# EAGLE design bmd-sbus-knobs-v2 (EAGLE 7.7.0)
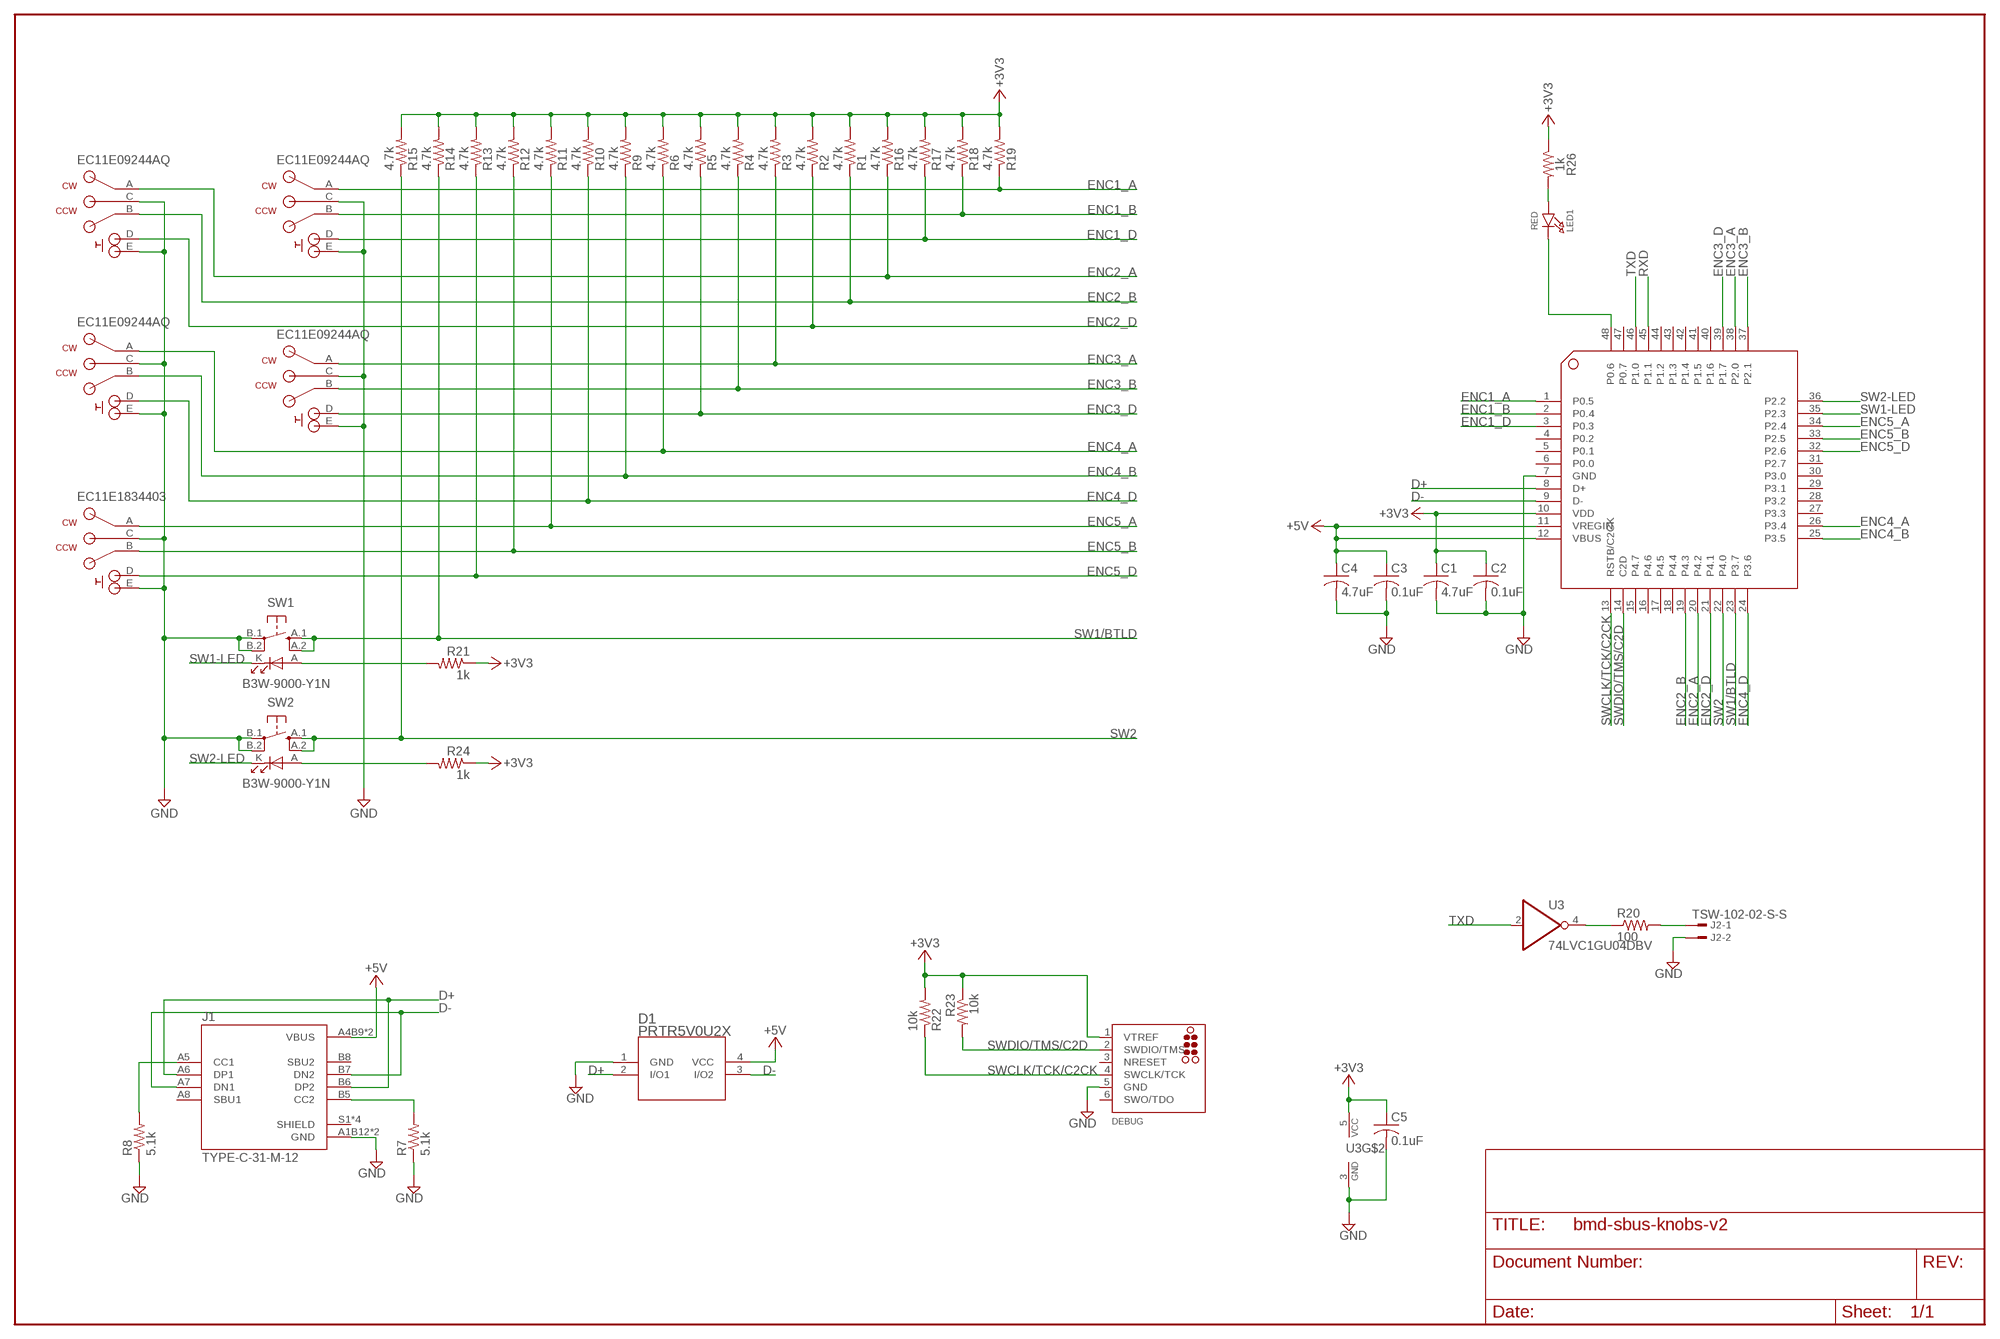
[diagram p0: schematic, sheet 1]

## Parts
C1  4.7uF  C-USC0603K  [C0603K]
C2  0.1uF  C-USC0603K  [C0603K]
C3  0.1uF  C-USC0603K  [C0603K]
C4  4.7uF  C-USC0603K  [C0603K]
C5  0.1uF  C-USC0603  [C0603]
D1  PRTR5V0U2X  [SOT143B]
DEBUG  TC2030-CTX-SWD  [TC2030-MCP-NL]
ENC1  EC11E15244B2  [EC11E15244B2]
ENC2  EC11E15244B2  [EC11E15244B2]
ENC3  EC11E15244B2  [EC11E15244B2]
ENC4  EC11E15244B2  [EC11E15244B2]
ENC5  EC11E15244B2  [EC11E15244B2]
J1  TYPE-C-31-M-12  [HRO_TYPE-C-31-M-12]
J2  TSW-102-02-S-S  [TSW-102-02-S-S]
LED1  RED  LED0805_NOOUTLINE  [CHIPLED_0805_NOOUTLINE]
R1  4.7k  R-US_R0603  [R0603]
R2  4.7k  R-US_R0603  [R0603]
R3  4.7k  R-US_R0603  [R0603]
R4  4.7k  R-US_R0603  [R0603]
R5  4.7k  R-US_R0603  [R0603]
R6  4.7k  R-US_R0603  [R0603]
R7  5.1k  R-US_R0603  [R0603]
R8  5.1k  R-US_R0603  [R0603]
R9  4.7k  R-US_R0603  [R0603]
R10  4.7k  R-US_R0603  [R0603]
R11  4.7k  R-US_R0603  [R0603]
R12  4.7k  R-US_R0603  [R0603]
R13  4.7k  R-US_R0603  [R0603]
R14  4.7k  R-US_R0603  [R0603]
R15  4.7k  R-US_R0603  [R0603]
R16  4.7k  R-US_R0603  [R0603]
R17  4.7k  R-US_R0603  [R0603]
R18  4.7k  R-US_R0603  [R0603]
R19  4.7k  R-US_R0603  [R0603]
R20  100  R-US_R0603  [R0603]
R21  1k  R-US_R0603  [R0603]
R22  10k  R-US_R0603  [R0603]
R23  10k  R-US_R0603  [R0603]
R24  1k  R-US_R0603  [R0603]
R26  1k  R-US_R0603  [R0603]
SW1  B3W-9000-Y1N  OMRON-B3W-9000-B1N  [OMRON-B3W-ILLUM-BUTTON]
SW2  B3W-9000-Y1N  OMRON-B3W-9000-B1N  [OMRON-B3W-ILLUM-BUTTON]
U1  EFM8UB20F64G-B-QFP48  [EFM8UB2-QFP48]
U3  74LVC1GU04DBV  74AHC1GU04DBV  [SOT23-5]

## Nets
+3V3: C1.1 C2.1 C5.1 DEBUG.1(VTREF) R1.2 R2.2 R3.2 R4.2 R5.2 R6.2 R9.2 R10.2 R11.2 R12.2 R13.2 R14.2 R15.2 R16.2 R17.2 R18.2 R19.2 R21.1 R22.2 R23.1 R24.1 R26.1 U1.10(VDD) U3.5(VCC)
+5V: C3.1 C4.1 D1.4(VCC) J1.A4B9(VBUS) J1.B4A9(VBUS) U1.11(VREGIN) U1.12(VBUS)
D+: D1.2(I/O1) J1.A6(DP1) J1.B6(DP2) U1.8(D+)
D-: D1.3(I/O2) J1.A7(DN1) J1.B7(DN2) U1.9(D-)
ENC1_A: ENC1.A R19.1 U1.1(P0.5)
ENC1_B: ENC1.B R18.1 U1.2(P0.4)
ENC1_D: ENC1.D R17.1 U1.3(P0.3)
ENC2_A: ENC2.A R16.1 U1.20(P4.2)
ENC2_B: ENC2.B R1.1 U1.19(P4.3)
ENC2_D: ENC2.D R2.1 U1.21(P4.1)
ENC3_A: ENC3.A R3.1 U1.38(P2.0)
ENC3_B: ENC3.B R4.1 U1.37(P2.1)
ENC3_D: ENC3.D R5.1 U1.39(P1.7)
ENC4_A: ENC4.A R6.1 U1.26(P3.4)
ENC4_B: ENC4.B R9.1 U1.25(P3.5)
ENC4_D: ENC4.D R10.1 U1.24(P3.6)
ENC5_A: ENC5.A R11.1 U1.34(P2.4)
ENC5_B: ENC5.B R12.1 U1.33(P2.5)
ENC5_D: ENC5.D R13.1 U1.32(P2.6)
GND: C1.2 C2.2 C3.2 C4.2 C5.2 D1.1(GND) DEBUG.5(GND) ENC1.C ENC1.E ENC2.C ENC2.E ENC3.C ENC3.E ENC4.C ENC4.E ENC5.C ENC5.E J1.A1B12(GND) J1.B1A12(GND) J2.2 R7.1 R8.1 SW1.B.1 SW1.B.2 SW2.B.1 SW2.B.2 U1.7(GND) U3.3(GND)
N$1: J2.1 R20.2
N$2: R20.1 U3.4(O)
N$3: LED1.A R26.2
N$4: R21.2 SW1.A
N$5: R24.2 SW2.A
N$19: LED1.C U1.48(P0.6)
N$20: J1.B5(CC2) R7.2
N$21: J1.A5(CC1) R8.2
RXD: U1.45(P1.1)
SW1-LED: SW1.K U1.35(P2.3)
SW1/BTLD: R14.1 SW1.A.1 SW1.A.2 U1.23(P3.7)
SW2: R15.1 SW2.A.1 SW2.A.2 U1.22(P4.0)
SW2-LED: SW2.K U1.36(P2.2)
SWCLK/TCK/C2CK: DEBUG.4(SWCLK/TCK) R22.1 U1.13(RSTB/C2CK)
SWDIO/TMS/C2D: DEBUG.2(SWDIO/TMS) R23.2 U1.14(C2D)
TXD: U1.46(P1.0) U3.2(I)
Unconnected: DEBUG.6(SWO/TDO) J1.A8(SBU1) J1.B8(SBU2) J1.S1(SHIELD) J1.S2(SHIELD) J1.S3(SHIELD) J1.S4(SHIELD) U1.4(P0.2) U1.5(P0.1) U1.6(P0.0) U1.15(P4.7) U1.16(P4.6) U1.17(P4.5) U1.18(P4.4) U1.27(P3.3) U1.28(P3.2) U1.29(P3.1) U1.30(P3.0) U1.31(P2.7) U1.40(P1.6) U1.41(P1.5) U1.42(P1.4) U1.43(P1.3) U1.44(P1.2) U1.47(P0.7)

## Notes on the sheet
- EC11E09244AQ | EC11E09244AQ
- EC11E09244AQ
- EC11E09244AQ
- EC11E1834403

## Power pins joined to a net without a drawn wire
NRESET: DEBUG.3(NRESET)

## Library data of the parts
C1-C5 = rcl:C-US: CAPACITOR, American symbol
D1 = Nexperia_PRTR5V0U2X,215:PRTR5V0U2X; MANUFACTURER_PART_NUMBER: PRTR5V0U2X; VENDOR: NXP
DEBUG = tag-connect:TC2030-CTX-SWD
ENC1-ENC5 = GlenPartsLibrary:EC11E15244B2
J1 = TYPE-C-31-M-12-OSHPARK:TYPE-C-31-M-12: USB Connectors 24 Receptacle 1 8.94*7.3mm RoHS; AVAILABILITY: Unavailable; DESCRIPTION: USB Connectors 24 Receptacle 1 8.94*7.3mm RoHS; MF: HRO Electronics Co., Ltd.; MP: TYPE-C-31-M-12; PACKAGE: Package; PRICE: None
J2 = con-samtec:TSW-102-02-S-S: THROUGH-HOLE .025" SQ POST HEADER Source: Samtec TSW.pdf; OC_FARNELL: unknown; OC_NEWARK: unknown
LED1 = microbuilder:LED: LED 0603 - 0603 Surface Mount Package 2mA: Green LED - Low Power (3.9mcd, 2ma, 1.7Vf) - Digikey: 475-2709-2-ND Orange LED - Low Power (9.8mcd, 2ma, 1.8Vf) - Digikey: 475-1194-2-ND Red LED - Low Power (5mcd, 2ma, 1.8Vf) - Digikey: 475-1195-2-ND Yellow LED - Low Power (7mcd, 2ma, 1.8Vf) - Digikey: 475-1196-2-ND 5mA: Blue LED - Low Power (17mcd, 5ma, 2.9Vf) - Digikey: LNJ937W8CRACT-ND 0805 - 0805 Surface Mount Package 2mA: Red LED (8.8mcd, 2mA, 1.8Vf, Clear) - Low Power [Digikey: 475-2510-1-ND] Green LED (5mcd, 2mA, 1.8Vf, Clear) - Low Power [Digikey: 475-2730-1-ND] Yellow LED (11.3mcd, 2mA, 1.8Vf, Clear) - Low Power [Digikey: 475-2555-1-ND] 20mA: Red LED (104mcd, 20mA, Diffused) - LS R976 [Digikey: 475-1278-6-ND] Red LED (12mcd, 20mA, 2.0Vf, Clear) - APT2012EC [Digikey: 754-1128-1-ND] Green LED (15mcd, 20mA, 2.2Vf, Clear) - APT2012GC [Digikey: 754-1131-1-ND] Orange LED (160mcd, 20mA, 2.1Vf, Clear) - APT2012SECK [Digikey: 754-1130-1-ND] 1206 - 1206 Surface Mount Package Green LED (26mcd, 20mA, Diffused) - LG N971 [Digikey: 475-1407-6-ND] Red LED (15mcd, 20mA, Diffused) - LH N974 [Digikey: 475-1416-6-ND] Cree - Cree High-Power Surface Mount LEDs XPEBWT-L1-0000-00D50 - White 111lm 350mA 2.9Vf 6200K 110° XTEAWT-00-0000-00000LEE3 - White 114lm 350mA 2.85Vf 5000K 115° Everlight - Everlight 45-21 Series Surface Mount LEDs 45-21/QK2C-B2832AC2CB2/2T - Warm White 2000mcd 20mA 3.25Vf 3050K 120° 45-21/LK2C-B38452C4CB2/2T - Nuetral White 2000mcd 20mA 3.25Vf 4150K 120° 45-21/LK2C-B50634C6CB2/2T - Cold White 2200mcd 20mA 3.25Vf 5650K 120° PLCC2 Reverse Mount LS T77K-J1L2-1-0-2-R18-Z - Red 11.25mcd 2mA 1.8Vf 630nm 120° LO T77K-L1M2-24-Z - Orange 19.6mcd 2mA 1.8Vf 606nm 120° LY T77K-K2M1-26-Z - Yellow 15.7mcd 2mA 1.8Vf 587nm 120°
R1-R24 R26 = rcl:R-US_: RESISTOR, American symbol
SW1 SW2 = GlenPartsLibrary:OMRON-B3W-9000-B1N
U1 = Glen-EFM8UB2:EFM8UB20F64G-B-QFP48
U3 = 74xx-little-de:74*1GU04: Single Unbuffered Inverter

## Board
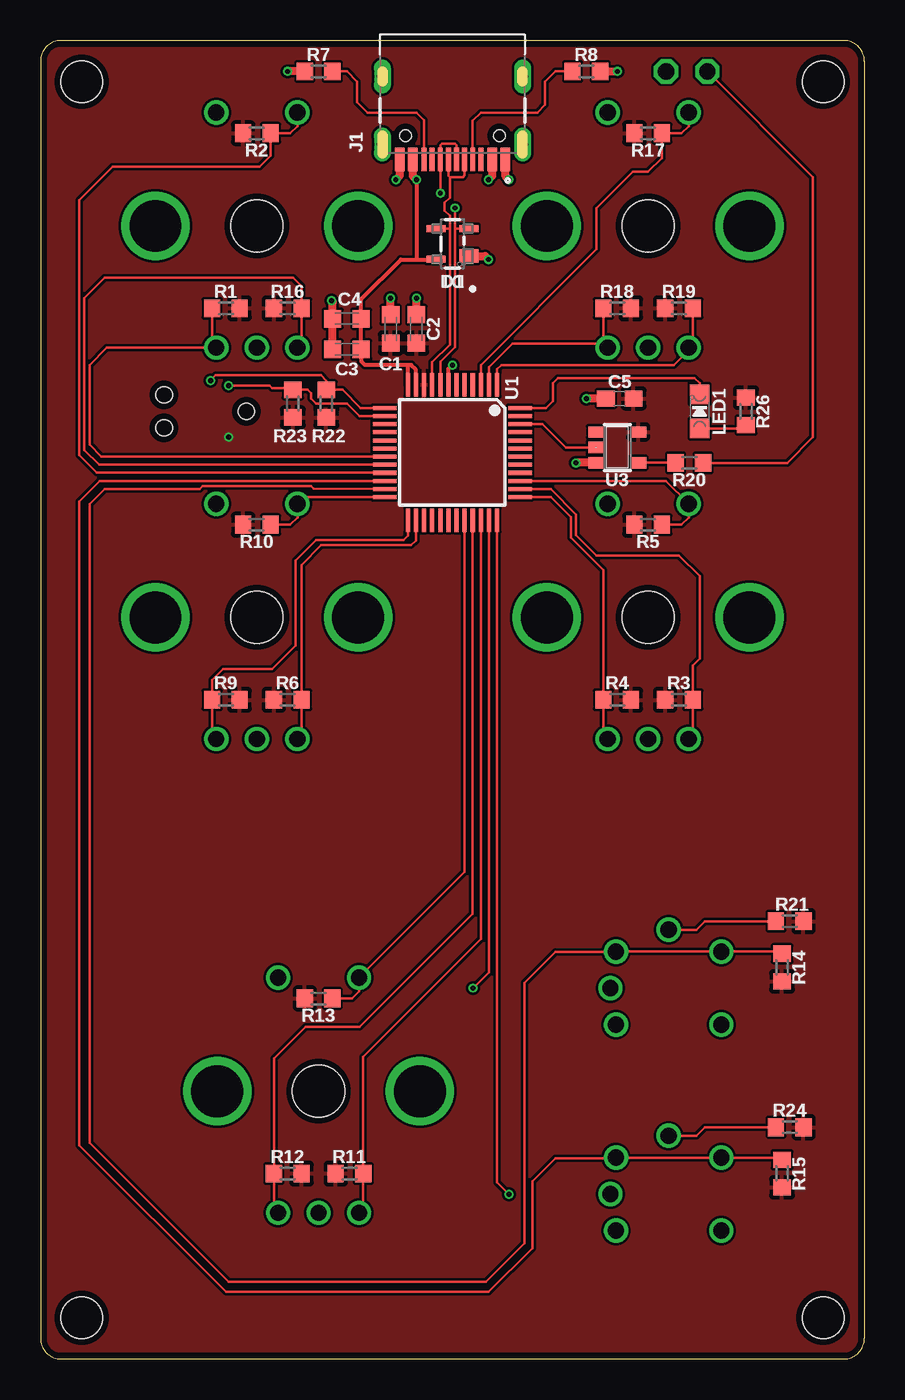
[diagram p1: board, top side]
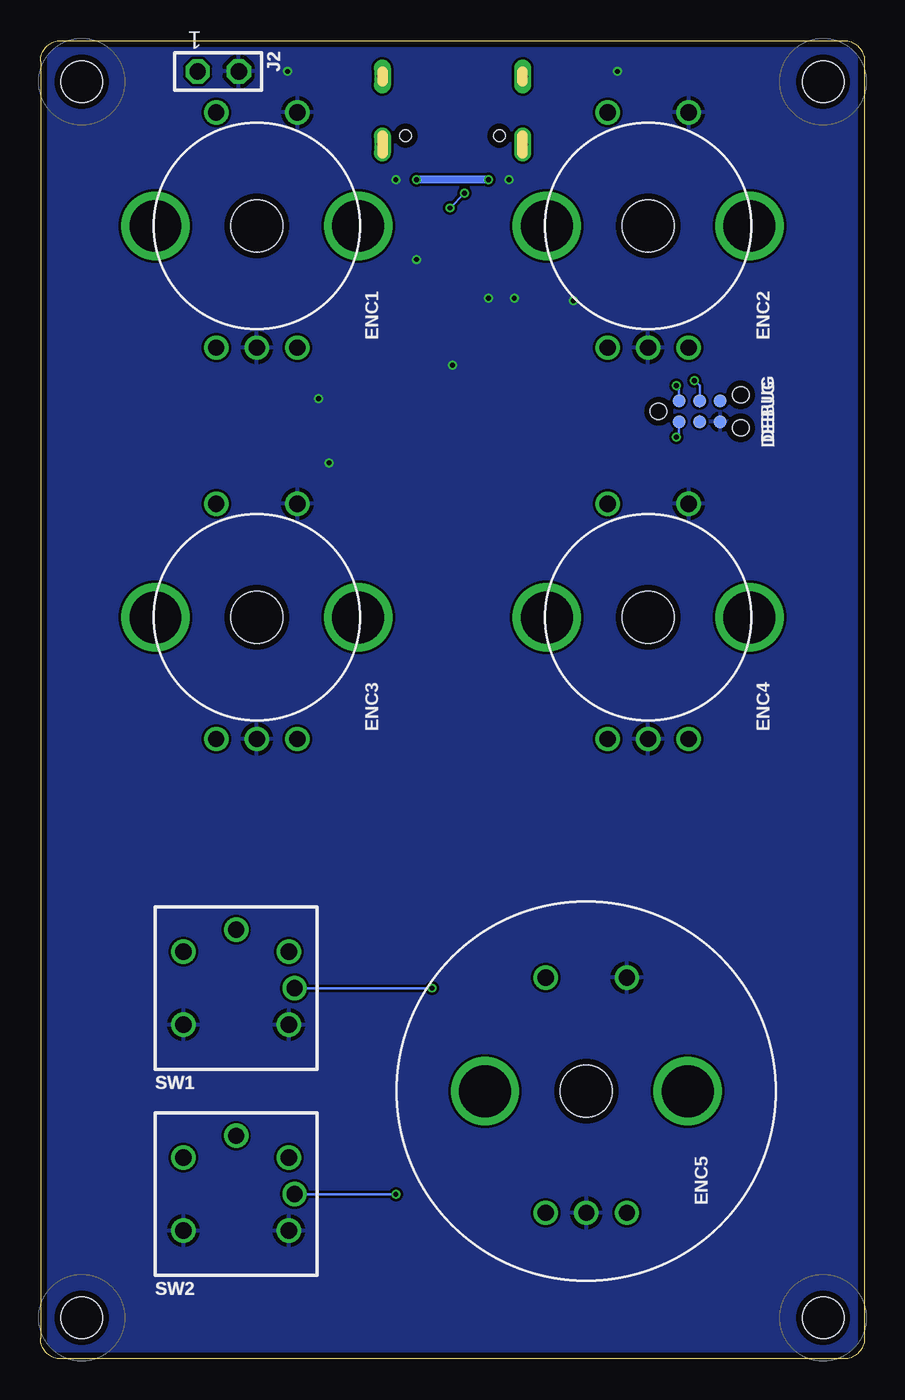
[diagram p2: board, bottom side, seen from below]

Size 50.8 x 81.28 mm. Coordinates in mm from the lower left corner, seen from the top.
Outline: 49.53,0 arc90 50.8,1.27 50.8,80.01 arc90 49.53,81.28 1.27,81.28 arc90 0,80.01 0,1.27 arc90 1.27,0 49.53,0
Copper layers (1*16): Top 0.035559375mm / dielectric 1.6mm / Bottom 0.035559375mm
Design rules "oshpark-2layer-2018": minimum track width 6mil, minimum drill 10mil, track to track 6mil, track to pad 6mil, pad to pad 6mil, via to via 6mil, smd to smd 6mil, copper to edge 15mil, drill to drill 6mil, minimum pad ring 5mil, minimum via ring 5mil, stop-mask expansion 2.5mil, vias tented up to drill 0mil, thermal gap 10mil
Holes 2.54 mm at 48.26,2.54 2.54,2.54 48.26,78.74 2.54,78.74
tKeepout: area 45.7,0 to 50.8,5.1; area 0,0 to 5.1,5.1; area 0,76.2 to 5.1,81.3; area 45.7,76.2 to 50.8,81.3
bKeepout: area 46.3,0 to 50.8,4.5; area 0,0 to 4.5,4.5; area 0,76.8 to 4.5,81.3; area 46.3,76.8 to 50.8,81.3

### Footprints (pad centres in the part's own frame; a part is rotated, then mirrored left to right if it is on the bottom)
C0603K = smd 1.05 x 1.08: 1 -0.875,0; 2 0.875,0
C0603 = smd 1.1 x 1: 1 -0.85,0; 2 0.85,0
SOT143B = smd 0.838 x 1.168: 1 -0.747,-1.016 | smd 0.432 x 1.168: 2 0.95,-1.016; 3 0.95,1.016; 4 -0.95,1.016
TC2030-MCP-NL = smd 0.787 x 0.787: 1 1.27,-0.635; 2 1.27,0.635; 3 2.54,-0.635; 4 2.54,0.635; 5 3.81,-0.635; 6 3.81,0.635 | hole 0.991: 0,0; 5.08,-1.016; 5.08,1.016
EC11E15244B2 = drill 1: A -2.5,-7.5; B 2.5,-7.5; C 0,-7.5; D -2.5,7; E 2.5,7 | drill 3.2: P$1 6.25,0; P$2 -6.25,0 | hole 3.2: 0,0
HRO_TYPE-C-31-M-12 = smd 0.6 x 1.45: A1B12 -3.25,5.095; A4B9 -2.45,5.095; B1A12 3.25,5.095; B4A9 2.45,5.095 | smd 0.3 x 1.45: A5 -1.25,5.095; A6 -0.25,5.095; A7 0.25,5.095; A8 1.25,5.095; B5 1.75,5.095; B6 0.75,5.095; B7 -0.75,5.095; B8 -1.75,5.095 | drill 0.65 pad 1.05 long: S1 -4.32,4.18; S2 4.32,4.18; S3 -4.32,0; S4 4.32,0 | hole 0.7: -2.89,3.65; 2.89,3.65
TSW-102-02-S-S = drill 1 pad 1.5 octagon: 1 1.27,0; 2 -1.27,0
CHIPLED_0805_NOOUTLINE = smd 1.2 x 1.2: A 0,-1.05; C 0,1.05
R0603 = smd 1 x 1.1: 1 -0.85,0; 2 0.85,0
OMRON-B3W-ILLUM-BUTTON = drill 1: A 0,3.6; A.1 -3.25,2.25; A.2 3.25,2.25; B.1 -3.25,-2.25; B.2 3.25,-2.25; K 3.6,0
EFM8UB2-QFP48 = smd 1.45 x 0.25: 1 -4.175,2.75; 2 -4.175,2.25; 3 -4.175,1.75; 4 -4.175,1.25; 5 -4.175,0.75; 6 -4.175,0.25; 7 -4.175,-0.25; 8 -4.175,-0.75; 9 -4.175,-1.25; 10 -4.175,-1.75; 11 -4.175,-2.25; 12 -4.175,-2.75; 25 4.175,-2.75; 26 4.175,-2.25; 27 4.175,-1.75; 28 4.175,-1.25; 29 4.175,-0.75; 30 4.175,-0.25; 31 4.175,0.25; 32 4.175,0.75; 33 4.175,1.25; 34 4.175,1.75; 35 4.175,2.25; 36 4.175,2.75 | smd 0.25 x 1.45: 13 -2.75,-4.175; 14 -2.25,-4.175; 15 -1.75,-4.175; 16 -1.25,-4.175; 17 -0.75,-4.175; 18 -0.25,-4.175; 19 0.25,-4.175; 20 0.75,-4.175; 21 1.25,-4.175; 22 1.75,-4.175; 23 2.25,-4.175; 24 2.75,-4.175; 37 2.75,4.175; 38 2.25,4.175; 39 1.75,4.175; 40 1.25,4.175; 41 0.75,4.175; 42 0.25,4.175; 43 -0.25,4.175; 44 -0.75,4.175; 45 -1.25,4.175; 46 -1.75,4.175; 47 -2.25,4.175; 48 -2.75,4.175
SOT23-5 = smd 0.69 x 0.99: 1 -0.95,-1.29; 2 0,-1.29; 3 0.95,-1.29; 4 0.95,1.3; 5 -0.95,1.3

### Placement (x,y rotation side)
C1  21.59,63.5 90 top
C2  23.18,63.5 90 top
C3  18.89,62.23 180 top
C4  18.89,64.14 180 top
C5  35.72,59.21 180 top
D1  25.4,68.74 90 top
DEBUG  12.7,58.42 0 bottom
ENC1  37.47,69.85 0 bottom
ENC2  13.34,69.85 0 bottom
ENC3  37.47,45.72 0 bottom
ENC4  13.34,45.72 0 bottom
ENC5  17.14,16.51 0 bottom
J1  25.4,79.06 180 top
J2  39.85,79.38 180 bottom
LED1  40.64,58.42 0 top
R1  11.43,64.77 0 top
R2  13.34,75.56 180 top
R3  39.37,40.64 180 top
R4  35.56,40.64 0 top
R5  37.47,51.44 180 top
R6  15.24,40.64 180 top
R7  17.14,79.38 0 top
R8  33.66,79.38 180 top
R9  11.43,40.64 0 top
R10  13.34,51.44 180 top
R11  19.05,11.43 180 top
R12  15.24,11.43 0 top
R13  17.14,22.23 180 top
R14  45.72,24.13 270 top
R15  45.72,11.43 270 top
R16  15.24,64.77 180 top
R17  37.47,75.56 180 top
R18  35.56,64.77 0 top
R19  39.37,64.77 180 top
R20  40.01,55.24 0 top
R21  46.2,26.99 180 top
R22  17.62,58.9 270 top
R23  15.56,58.9 90 top
R24  46.2,14.29 180 top
R26  43.5,58.42 270 top
SW1  38.73,22.86 0 bottom
SW2  38.73,10.16 0 bottom
U1  25.4,55.88 270 top
U3  35.56,56.2 270 top

### Tracks (layer width: path | path; a pad name or v marks a point on that pad's centre or on a via)
+3V3  (via drill 0.3)
  Bottom 0.152: DEBUG.1 11.43,56.99 v11.59,56.83
  pour Top (isolate 0.152): 50.8,0 0,0 0,81.28 50.8,81.28
+5V  (via drill 0.3)
  Top 0.254: 23.18,67.79 D1.4 | U1.11 23.15,60.99 22.86,61.28 22.65,61.28 | 22.65,61.28 20,61.28 19.77,61.51 C3.1 C4.1 19.77,65.33 22.23,67.79 23.18,67.79 | U1.12 22.65,61.28 | v23.18,72.71 23.18,67.79
  Top 0.508: J1.B4A9 22.95,72.94 v23.18,72.71 | J1.A4B9 27.85,72.94 v27.62,72.71
  Bottom 0.508: v23.18,72.71 v27.62,72.71
D+  (via drill 0.3)
  Top 0.152: U1.8 24.65,61.48 25.56,62.39 25.56,69.69 | J1.A6 25.65,74.84 25.56,74.93 24.77,74.93 24.65,74.81 J1.B6 v24.65,71.87 | 25.56,69.85 25.56,69.69 | v25.56,70.96 25.56,69.69 | D1.2 25.56,69.69
  Bottom 0.152: v24.65,71.87 v25.56,70.96
D-
  Top 0.152: U1.9 24.15,61.46 25.24,62.55 25.24,69.69 | D1.3 25.08,69.69 25.24,69.69 | J1.B7 26.15,72.98 26.04,72.87 25.24,72.87 | J1.A7 25.15,72.96 25.24,72.87 | 25.24,69.69 25.24,70.48 24.92,70.8 24.92,71.28 25.24,71.6 25.24,72.87
ENC1_A
  Top 0.152: R19.1 40.22,62.6 ENC1.A 39.97,62.19 39.05,61.28 28.42,61.28 28.15,61.01 U1.1
ENC1_B
  Top 0.152: R18.1 34.71,62.6 | 34.71,62.6 ENC1.B | 34.71,62.6 29.11,62.6 27.65,61.15 U1.2
ENC1_D
  Top 0.152: ENC1.D 39.97,76 39.53,75.56 R17.1 38.31,74.03 37.47,73.18 36.51,73.18 34.29,70.96 34.29,68.42 27.15,61.28 U1.3
ENC2_A
  Top 0.152: ENC2.A 16.09,62.6 R16.1 16.09,66.14 15.56,66.67 3.97,66.67 2.7,65.41 2.7,56.04 3.61,55.13 U1.20
ENC2_B
  Top 0.152: R1.1 10.58,62.6 ENC2.B 4.09,62.35 3.02,61.28 3.02,56.36 3.74,55.63 U1.19
ENC2_D
  Top 0.152: ENC2.D 15.84,76 15.4,75.56 R2.1 14.19,74.19 13.49,73.5 4.45,73.5 2.38,71.44 2.38,55.72 3.47,54.63 U1.21
ENC3_A
  Top 0.152: ENC3.A 40.22,38.48 R3.1 40.22,42.76 40.64,43.18 40.64,48.26 39.37,49.53 34.29,49.53 33.02,50.8 33.02,52.07 31.46,53.63 U1.38
ENC3_B
  Top 0.152: ENC3.B 34.71,38.48 R4.1 34.71,48.63 32.7,50.64 32.7,51.91 31.48,53.13 U1.37
ENC3_D
  Top 0.152: R5.1 39.53,51.44 39.97,51.87 ENC3.D 38.55,54.13 U1.39
ENC4_A
  Top 0.152: ENC4.A 16.09,38.48 R6.1 16.09,48.95 17.3,50.16 22.86,50.16 23.15,50.45 U1.26
ENC4_B
  Top 0.152: ENC4.B 10.58,38.48 R9.1 10.58,41.85 11.27,42.55 14.29,42.55 15.72,43.97 15.72,49.21 16.99,50.48 22.38,50.48 22.65,50.75 U1.25
ENC4_D
  Top 0.152: R10.1 15.4,51.44 15.84,51.87 ENC4.D 16.25,53.13 U1.24
ENC5_A
  Top 0.152: ENC5.A 19.9,9.27 R11.1 19.9,18.63 27.15,25.88 U1.34
ENC5_B
  Top 0.152: ENC5.B 14.39,9.27 R12.1 14.39,18.52 16.35,20.48 19.68,20.48 26.65,27.44 U1.33
ENC5_D
  Top 0.152: R13.1 19.21,22.23 19.64,22.66 ENC5.D 26.15,30.02 U1.32
GND  (via drill 0.3)
  Top 0.254: U1.7 25.15,61.03 v25.4,61.28
  Top 0.508: R7.1 v15.24,79.38 | R8.1 v35.56,79.38 | D1.1 27.42,67.99 v27.62,67.79 | C3.2 C4.2 18.02,65.17 v17.94,65.25 | C1.2 v21.59,65.41 | C2.2 v23.18,65.41 | J1.B1A12 22.15,72.95 v21.91,72.71 | J1.A1B12 28.65,72.95 v28.89,72.71 | C5.2 v33.66,59.21 | U3.3 v33.02,55.25 v33.02,55.24
  pour Bottom (isolate 0.152): 50.8,0 0,0 0,81.28 50.8,81.28
N$1
  Top 0.152: J2.1 47.62,72.87 47.62,56.83 46.04,55.24 R20.2
N$2
  Top 0.152: U3.4 R20.1
N$3
  Top 0.152: LED1.A 43.3,57.37 R26.2
N$4
  Top 0.152: SW1.A 40.43,26.46 40.96,26.99 R21.2
N$5
  Top 0.152: SW2.A 40.43,13.76 40.96,14.29 R24.2
N$19
  Top 0.152: U1.48 31.17,58.63 31.59,59.05 31.59,60.17 31.91,60.48 40.32,60.48 40.64,60.17 LED1.C
N$20
  Top 0.152: R7.2 18.89,79.38 19.53,78.74 19.53,77.47 20.16,76.83 23.18,76.83 23.65,76.36 J1.B5
N$21
  Top 0.152: J1.A5 26.65,76.34 27.15,76.83 30.64,76.83 31.11,77.31 31.11,78.74 31.75,79.38 R8.2
SW1-LED  (via drill 0.3)
  Top 0.152: U1.35 27.65,23.84 v26.67,22.86
  Bottom 0.152: v26.67,22.86 SW1.K
SW1/BTLD
  Top 0.152: U1.23 16.83,53.66 16.67,53.82 10,53.82 9.81,53.63 3.94,53.63 3.02,52.7 3.02,13.34 11.59,4.76 27.46,4.76 29.84,7.14 29.84,23.18 31.75,25.08 35.46,25.08 SW1.A.2 SW1.A.1 45.59,25.11 R14.1
SW2
  Top 0.152: R15.1 45.59,12.41 SW2.A.1 SW2.A.2 35.46,12.38 31.75,12.38 30.32,10.95 30.32,6.83 27.62,4.13 11.43,4.13 2.38,13.18 2.38,52.86 3.65,54.13 U1.22
SW2-LED  (via drill 0.3)
  Top 0.152: U1.36 28.15,10.9 v28.89,10.16
  Bottom 0.152: v28.89,10.16 SW2.K
SWCLK/TCK/C2CK  (via drill 0.3)
  Top 0.152: v10.48,60.33 10.79,60.64 17.3,60.64 17.62,60.33 R22.1 18.63,59.75 19.75,58.63 U1.13
  Bottom 0.152: DEBUG.4 10.16,60.01 v10.48,60.33
SWDIO/TMS/C2D  (via drill 0.3)
  Top 0.152: v11.59,60.01 14.13,60.01 14.29,59.85 15.46,59.85 R23.2 16.45,59.75 16.67,59.53 16.67,59.21 16.99,58.9 18.89,58.9 19.66,58.13 U1.14
  Bottom 0.152: DEBUG.2 11.43,59.85 v11.59,60.01
TXD
  Top 0.152: U1.46 30.95,57.63 32.38,56.2 U3.2

### Text on the board
_tsilk: R7 | R8 | R2 | R17 | J1 | D1 | R1 | R16 | C4 | R18 | R19 | C2 | C1 | C3 | C5 | U1 | LED1 | R26 | R23 | R22 | U3 | R20 | R10 | R5 | R9 | R6 | R4 | R3 | R21 | R14 | R13 | R24 | R12 | R11 | R15
_bsilk: J2 | DEBUG | SW1 | SW2